# Altium schematic sheet AZ1143-04F.schdoc
size 124 x 101 mm
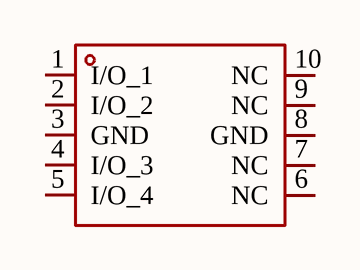
[diagram p0: AZ1143-04F.schdoc]

## Parts
U?  AZ1143-04F  [DFN-10_L2.5-W1.0-P0.50-BL-A]  (value not drawn)

## Nets

Not connected (* = marked no-connect by the designer): U? 1(I/O_1) 2(I/O_2) 3(GND) 4(I/O_3) 5(I/O_4) 6(NC) 7(NC) 8(GND) 9(NC) 10(NC)

## Library data of the parts
U? = AZ1143-04F: Manufacturer: TECH PUBLIC(台舟); Add into BOM: yes; Symbol: AZ1143-04F; Device: AZ1143-04F; LCSC Part Name: AZ1143-04F; Supplier Part: C19829450; Manufacturer Part: AZ1143-04F; Supplier Footprint: DFN2510-10L; JLCPCB Part Class: Extended Part; Datasheet: https://atta.szlcsc.com/upload/public/pdf/source/20240119/FEE8D70A7D8B66A28DC87CD690CAAB55.pdf; Supplier: LCSC; Convert to PCB: yes